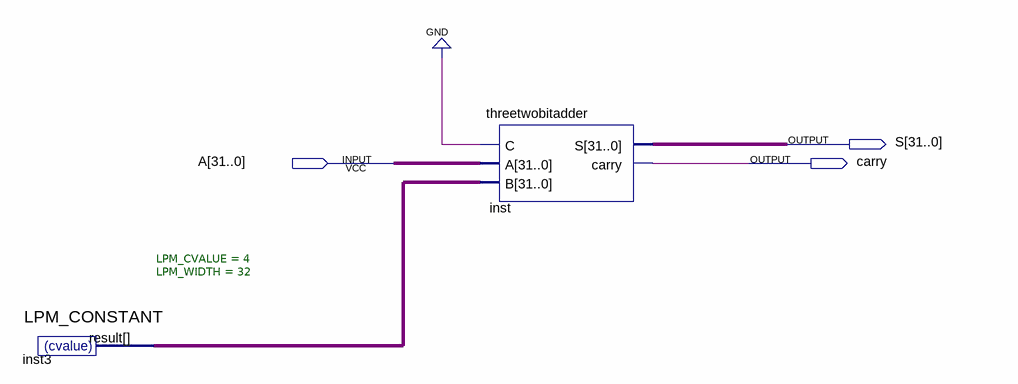
[diagram p0: schematic sheet]
// Quartus schematic addfour.bdf as structural Verilog: 2 symbols, 3 pins
module addfour (
  input  [31:0] A,
  output [31:0] S,
  output carry
);

  wire [31:0] inst3_result;

  LPM_CONSTANT #(.LPM_CVALUE(4), .LPM_WIDTH(32)) inst3 (.result(inst3_result));
  threetwobitadder inst (.C(1'b0), .A(A), .B(inst3_result), .S(S), .carry(carry));
endmodule
